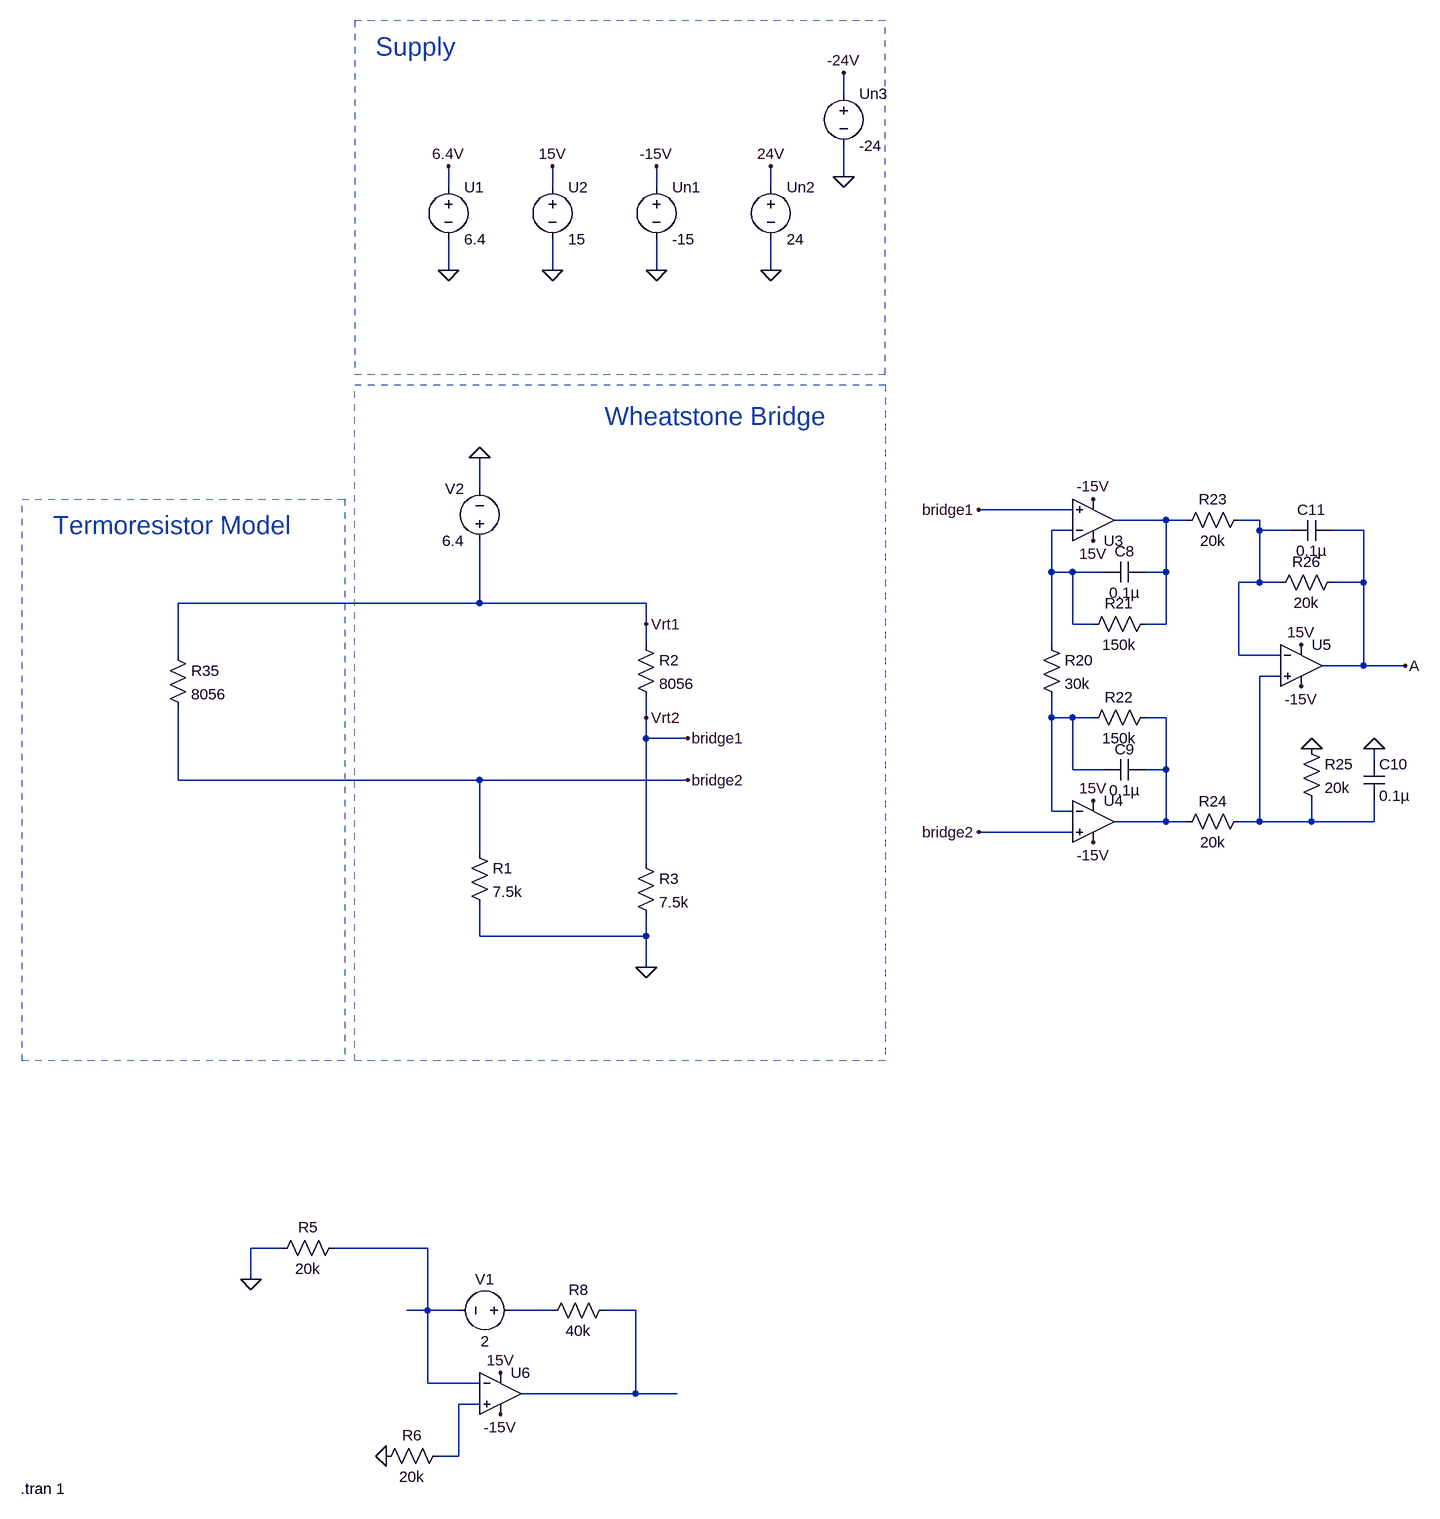
[diagram p0: schematic Draft1.asc]
Draft1.asc, the LTspice schematic file:
Version 4
SHEET 1 880 1572
WIRE -2448 -2144 -2448 -2176
WIRE -2448 -2016 -2448 -2064
WIRE -3056 -2000 -3056 -2032
WIRE -2896 -2000 -2896 -2032
WIRE -2736 -2000 -2736 -2032
WIRE -2560 -2000 -2560 -2032
WIRE -3056 -1872 -3056 -1920
WIRE -2896 -1872 -2896 -1920
WIRE -2736 -1872 -2736 -1920
WIRE -2560 -1872 -2560 -1920
WIRE -3008 -1536 -3008 -1584
WIRE -2096 -1504 -2240 -1504
WIRE -1952 -1488 -2032 -1488
WIRE -1920 -1488 -1952 -1488
WIRE -1808 -1488 -1840 -1488
WIRE -2096 -1472 -2128 -1472
WIRE -1808 -1472 -1808 -1488
WIRE -1760 -1472 -1808 -1472
WIRE -1648 -1472 -1696 -1472
WIRE -2128 -1408 -2128 -1472
WIRE -2096 -1408 -2128 -1408
WIRE -2048 -1408 -2096 -1408
WIRE -1952 -1408 -1952 -1488
WIRE -1952 -1408 -1984 -1408
WIRE -1808 -1392 -1808 -1472
WIRE -1808 -1392 -1840 -1392
WIRE -1776 -1392 -1808 -1392
WIRE -1648 -1392 -1648 -1472
WIRE -1648 -1392 -1696 -1392
WIRE -3008 -1360 -3008 -1456
WIRE -3008 -1360 -3472 -1360
WIRE -2752 -1360 -3008 -1360
WIRE -2752 -1328 -2752 -1360
WIRE -2096 -1328 -2096 -1408
WIRE -2064 -1328 -2096 -1328
WIRE -1952 -1328 -1952 -1408
WIRE -1952 -1328 -1984 -1328
WIRE -2752 -1296 -2752 -1328
WIRE -2128 -1296 -2128 -1408
WIRE -3472 -1280 -3472 -1360
WIRE -1840 -1280 -1840 -1392
WIRE -1776 -1280 -1840 -1280
WIRE -1648 -1264 -1648 -1392
WIRE -1648 -1264 -1712 -1264
WIRE -1584 -1264 -1648 -1264
WIRE -1776 -1248 -1808 -1248
WIRE -2752 -1184 -2752 -1216
WIRE -2128 -1184 -2128 -1216
WIRE -2096 -1184 -2128 -1184
WIRE -2064 -1184 -2096 -1184
WIRE -1952 -1184 -1984 -1184
WIRE -2752 -1152 -2752 -1184
WIRE -2688 -1152 -2752 -1152
WIRE -1632 -1120 -1632 -1136
WIRE -2096 -1104 -2096 -1184
WIRE -2048 -1104 -2096 -1104
WIRE -1952 -1104 -1952 -1184
WIRE -1952 -1104 -1984 -1104
WIRE -3472 -1088 -3472 -1200
WIRE -3008 -1088 -3472 -1088
WIRE -2688 -1088 -3008 -1088
WIRE -2128 -1040 -2128 -1184
WIRE -2096 -1040 -2128 -1040
WIRE -1952 -1024 -1952 -1104
WIRE -1952 -1024 -2032 -1024
WIRE -1920 -1024 -1952 -1024
WIRE -1808 -1024 -1808 -1248
WIRE -1808 -1024 -1840 -1024
WIRE -1728 -1024 -1728 -1056
WIRE -1728 -1024 -1808 -1024
WIRE -1632 -1024 -1632 -1056
WIRE -1632 -1024 -1728 -1024
WIRE -2096 -1008 -2240 -1008
WIRE -3008 -976 -3008 -1088
WIRE -2752 -960 -2752 -1152
WIRE -3008 -848 -3008 -896
WIRE -2752 -848 -2752 -880
WIRE -2752 -848 -3008 -848
WIRE -2752 -800 -2752 -848
WIRE -3312 -368 -3360 -368
WIRE -3088 -368 -3232 -368
WIRE -3360 -320 -3360 -368
WIRE -3088 -272 -3088 -368
WIRE -3088 -272 -3120 -272
WIRE -3040 -272 -3088 -272
WIRE -2896 -272 -2960 -272
WIRE -2768 -272 -2816 -272
WIRE -3088 -160 -3088 -272
WIRE -3008 -160 -3088 -160
WIRE -2768 -144 -2768 -272
WIRE -2768 -144 -2944 -144
WIRE -2704 -144 -2768 -144
WIRE -3008 -128 -3040 -128
WIRE -3040 -48 -3040 -128
WIRE -3040 -48 -3072 -48
FLAG -3056 -1872 0
FLAG -3056 -2032 6.4V
FLAG -2752 -800 0
FLAG -2896 -1872 0
FLAG -2896 -2032 15V
FLAG -2736 -1872 0
FLAG -2736 -2032 -15V
FLAG -2064 -1056 15V
FLAG -2064 -992 -15V
FLAG -2560 -1872 0
FLAG -2560 -2032 24V
FLAG -2688 -1152 bridge1
FLAG -2688 -1088 bridge2
FLAG -2240 -1504 bridge1
FLAG -2240 -1008 bridge2
FLAG -1584 -1264 A
FLAG -2752 -1328 Vrt1
FLAG -2752 -1184 Vrt2
FLAG -1728 -1136 0
FLAG -1632 -1136 0
FLAG -2064 -1456 15V
FLAG -2064 -1520 -15V
FLAG -1744 -1232 -15V
FLAG -1744 -1296 15V
FLAG -2448 -2016 0
FLAG -2448 -2176 -24V
FLAG -2976 -112 -15V
FLAG -2976 -176 15V
FLAG -3152 -48 0
FLAG -3360 -320 0
FLAG -3008 -1584 0
SYMBOL voltage -3056 -2016 R0
WINDOW 123 0 0 Left 0
WINDOW 39 0 0 Left 0
SYMATTR InstName U1
SYMATTR Value 6.4
SYMBOL res -3024 -992 R0
SYMATTR InstName R1
SYMATTR Value 7.5k
SYMBOL res -2768 -1312 R0
SYMATTR InstName R2
SYMATTR Value 8056
SYMBOL res -2768 -976 R0
SYMATTR InstName R3
SYMATTR Value 7.5k
SYMBOL voltage -2896 -2016 R0
WINDOW 123 0 0 Left 0
WINDOW 39 0 0 Left 0
SYMATTR InstName U2
SYMATTR Value 15
SYMBOL voltage -2736 -2016 R0
WINDOW 123 0 0 Left 0
WINDOW 39 0 0 Left 0
SYMATTR InstName Un1
SYMATTR Value -15
SYMBOL voltage -2560 -2016 R0
WINDOW 123 0 0 Left 0
WINDOW 39 0 0 Left 0
SYMATTR InstName Un2
SYMATTR Value 24
SYMBOL res -2144 -1312 R0
SYMATTR InstName R20
SYMATTR Value 30k
SYMBOL res -1968 -1344 R90
WINDOW 0 0 56 VBottom 2
WINDOW 3 32 56 VTop 2
SYMATTR InstName R21
SYMATTR Value 150k
SYMBOL res -1968 -1200 R90
WINDOW 0 0 56 VBottom 2
WINDOW 3 32 56 VTop 2
SYMATTR InstName R22
SYMATTR Value 150k
SYMBOL cap -1984 -1424 R90
WINDOW 0 0 32 VBottom 2
WINDOW 3 32 32 VTop 2
SYMATTR InstName C8
SYMATTR Value 0.1µ
SYMBOL cap -1984 -1120 R90
WINDOW 0 0 32 VBottom 2
WINDOW 3 32 32 VTop 2
SYMATTR InstName C9
SYMATTR Value 0.1µ
SYMBOL res -1824 -1504 R90
WINDOW 0 0 56 VBottom 2
WINDOW 3 32 56 VTop 2
SYMATTR InstName R23
SYMATTR Value 20k
SYMBOL res -1824 -1040 R90
WINDOW 0 0 56 VBottom 2
WINDOW 3 32 56 VTop 2
SYMATTR InstName R24
SYMATTR Value 20k
SYMBOL res -1744 -1152 R0
SYMATTR InstName R25
SYMATTR Value 20k
SYMBOL res -1680 -1408 R90
WINDOW 0 0 56 VBottom 2
WINDOW 3 32 56 VTop 2
SYMATTR InstName R26
SYMATTR Value 20k
SYMBOL cap -1648 -1120 R0
SYMATTR InstName C10
SYMATTR Value 0.1µ
SYMBOL cap -1696 -1488 R90
WINDOW 0 0 32 VBottom 2
WINDOW 3 32 32 VTop 2
SYMATTR InstName C11
SYMATTR Value 0.1µ
SYMBOL res -3488 -1296 R0
SYMATTR InstName R35
SYMATTR Value 8056
SYMBOL Opamps\\UniversalOpamp2 -2064 -1488 M180
SYMATTR InstName U3
SYMATTR Value2 Avol=250k GBW=10Meg Slew=10Meg
SYMBOL Opamps\\UniversalOpamp2 -2064 -1024 R0
SYMATTR InstName U4
SYMATTR Value2 Avol=250k GBW=10Meg Slew=10Meg
SYMBOL Opamps\\UniversalOpamp2 -1744 -1264 R0
SYMATTR InstName U5
SYMATTR Value2 Avol=250k GBW=10Meg Slew=10Meg
SYMBOL voltage -2448 -2160 R0
WINDOW 123 0 0 Left 0
WINDOW 39 0 0 Left 0
SYMATTR InstName Un3
SYMATTR Value -24
SYMBOL res -3216 -384 R90
WINDOW 0 0 56 VBottom 2
WINDOW 3 32 56 VTop 2
SYMATTR InstName R5
SYMATTR Value 20k
SYMBOL res -3056 -64 R90
WINDOW 0 0 56 VBottom 2
WINDOW 3 32 56 VTop 2
SYMATTR InstName R6
SYMATTR Value 20k
SYMBOL res -2800 -288 R90
WINDOW 0 0 56 VBottom 2
WINDOW 3 32 56 VTop 2
SYMATTR InstName R8
SYMATTR Value 40k
SYMBOL Opamps\\UniversalOpamp2 -2976 -144 R0
SYMATTR InstName U6
SYMATTR Value2 Avol=250k GBW=10Meg Slew=10Meg
SYMBOL voltage -2944 -272 R90
WINDOW 0 -32 56 VBottom 2
WINDOW 3 32 56 VTop 2
WINDOW 123 0 0 Left 0
WINDOW 39 0 0 Left 0
SYMATTR InstName V1
SYMATTR Value 2
SYMBOL voltage -3008 -1440 R180
WINDOW 0 24 96 Left 2
WINDOW 3 24 16 Left 2
WINDOW 123 0 0 Left 0
WINDOW 39 0 0 Left 0
SYMATTR InstName V2
SYMATTR Value 6.4
TEXT -2816 -1648 Left 4 ;Wheatstone Bridge
TEXT -3168 -2216 Left 4 ;Supply
TEXT -3664 -1480 Left 4 ;Termoresistor Model
TEXT -3714 2 Left 2 !.tran 1
RECTANGLE Normal -2384 -656 -3200 -1696 2
RECTANGLE Normal -2384 -2256 -3200 -1712 2
RECTANGLE Normal -3216 -656 -3712 -1520 2

The netlist it stands for:
* Draft1.asc
V§U1 6.4V 0 6.4
R1 bridge2 0 7.5k
R2 Vrt1 Vrt2 8056
R3 Vrt2 0 7.5k
V§U2 15V 0 15
V§Un1 -15V 0 -15
V§Un2 24V 0 24
R20 N003 N005 30k
R21 N001 N003 150k
R22 N006 N005 150k
C8 N001 N003 0.1µ
C9 N006 N005 0.1µ
R23 N002 N001 20k
R24 N004 N006 20k
R25 0 N004 20k
R26 A N002 20k
C10 0 N004 0.1µ
C11 A N002 0.1µ
R35 Vrt1 bridge2 8056
XU3 Vrt2 N003 15V -15V N001 level.2 Avol=250k GBW=10Meg Slew=10Meg ilimit=25m rail=0 Vos=0 phimargin=45 en=0 enk=0 in=0 ink=0 Rin=500Meg  ; pins IN+ IN- V+ V- OUT
XU4 bridge2 N005 15V -15V N006 level.2 Avol=250k GBW=10Meg Slew=10Meg ilimit=25m rail=0 Vos=0 phimargin=45 en=0 enk=0 in=0 ink=0 Rin=500Meg  ; pins IN+ IN- V+ V- OUT
XU5 N004 N002 15V -15V A level.2 Avol=250k GBW=10Meg Slew=10Meg ilimit=25m rail=0 Vos=0 phimargin=45 en=0 enk=0 in=0 ink=0 Rin=500Meg  ; pins IN+ IN- V+ V- OUT
V§Un3 -24V 0 -24
R5 N007 0 20k
R6 N010 0 20k
R8 N009 N008 40k
XU6 N010 N007 15V -15V N009 level.2 Avol=250k GBW=10Meg Slew=10Meg ilimit=25m rail=0 Vos=0 phimargin=45 en=0 enk=0 in=0 ink=0 Rin=500Meg  ; pins IN+ IN- V+ V- OUT
V1 N008 N007 2
V2 Vrt1 0 6.4
* Wheatstone Bridge
* Supply
* Termoresistor Model
.tran 1
.lib UniversalOpamps2.sub
.backanno
.end